# Altium project Potentiometer_breakout_module.PrjPcb
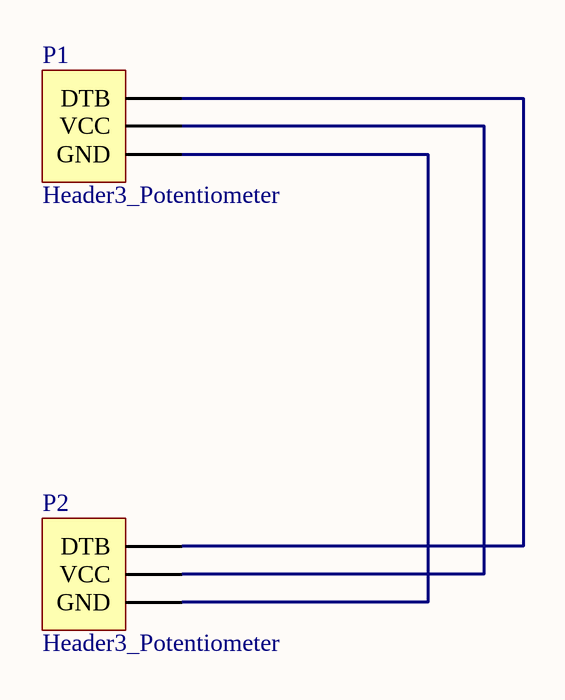
[diagram p0: Potentiometer_breakout_module.SchDoc]
1 sheet, 2 parts. Net scope: global (net labels, ports and power ports of the same name join across sheets).
Board file: Potentiometer_breakout_module.PcbDoc

## Sheet Potentiometer_breakout_module.SchDoc: Slide potentiometer breakout module
size A4; Author: Andrea Mancini; DocumentNumber: 1; Revision: 1; SheetNumber: 1; SheetTotal: 1; FileName: Potentiometer_breakout_module.SchDoc; DescriptionLine1: Breakout module for; DescriptionLine2: common slide potentiometers; DescriptionLine3: with pin welded

### Parts
P1  Header3_Potentiometer  [HDR1X3_Potentiometer]
P2  Header3_Potentiometer  [HDR1X3_Potentiometer]

### Nets
NetP1_1: P1.1(GND) P2.1(GND)
NetP1_2: P1.2(VCC) P2.2(VCC)
NetP1_3: P1.3(DTB) P2.3(DTB)

### Notes on the sheet
- Title
- Size:
- Date:
- A4
- Number:
- Time:
- Revision:
- Sheet
- of
- Author:
- File: